# Altium schematic sheet EPS_Headers.SchDoc: UCI EPS 2021-22 Draft 1
size 304 x 254 mm; Origin: Eagle; Date: 3/6/2024 11:58:42 PM; SheetNumber: 1; GateName_1: G$1; SymbolName_1: FRAME_A_L; LibraryName: frames; DeviceSetName: FRAME_A_L; GateName_2: G$2; SymbolName_2: DOCFIELD; Sheet: Sheet:; REV: REV:
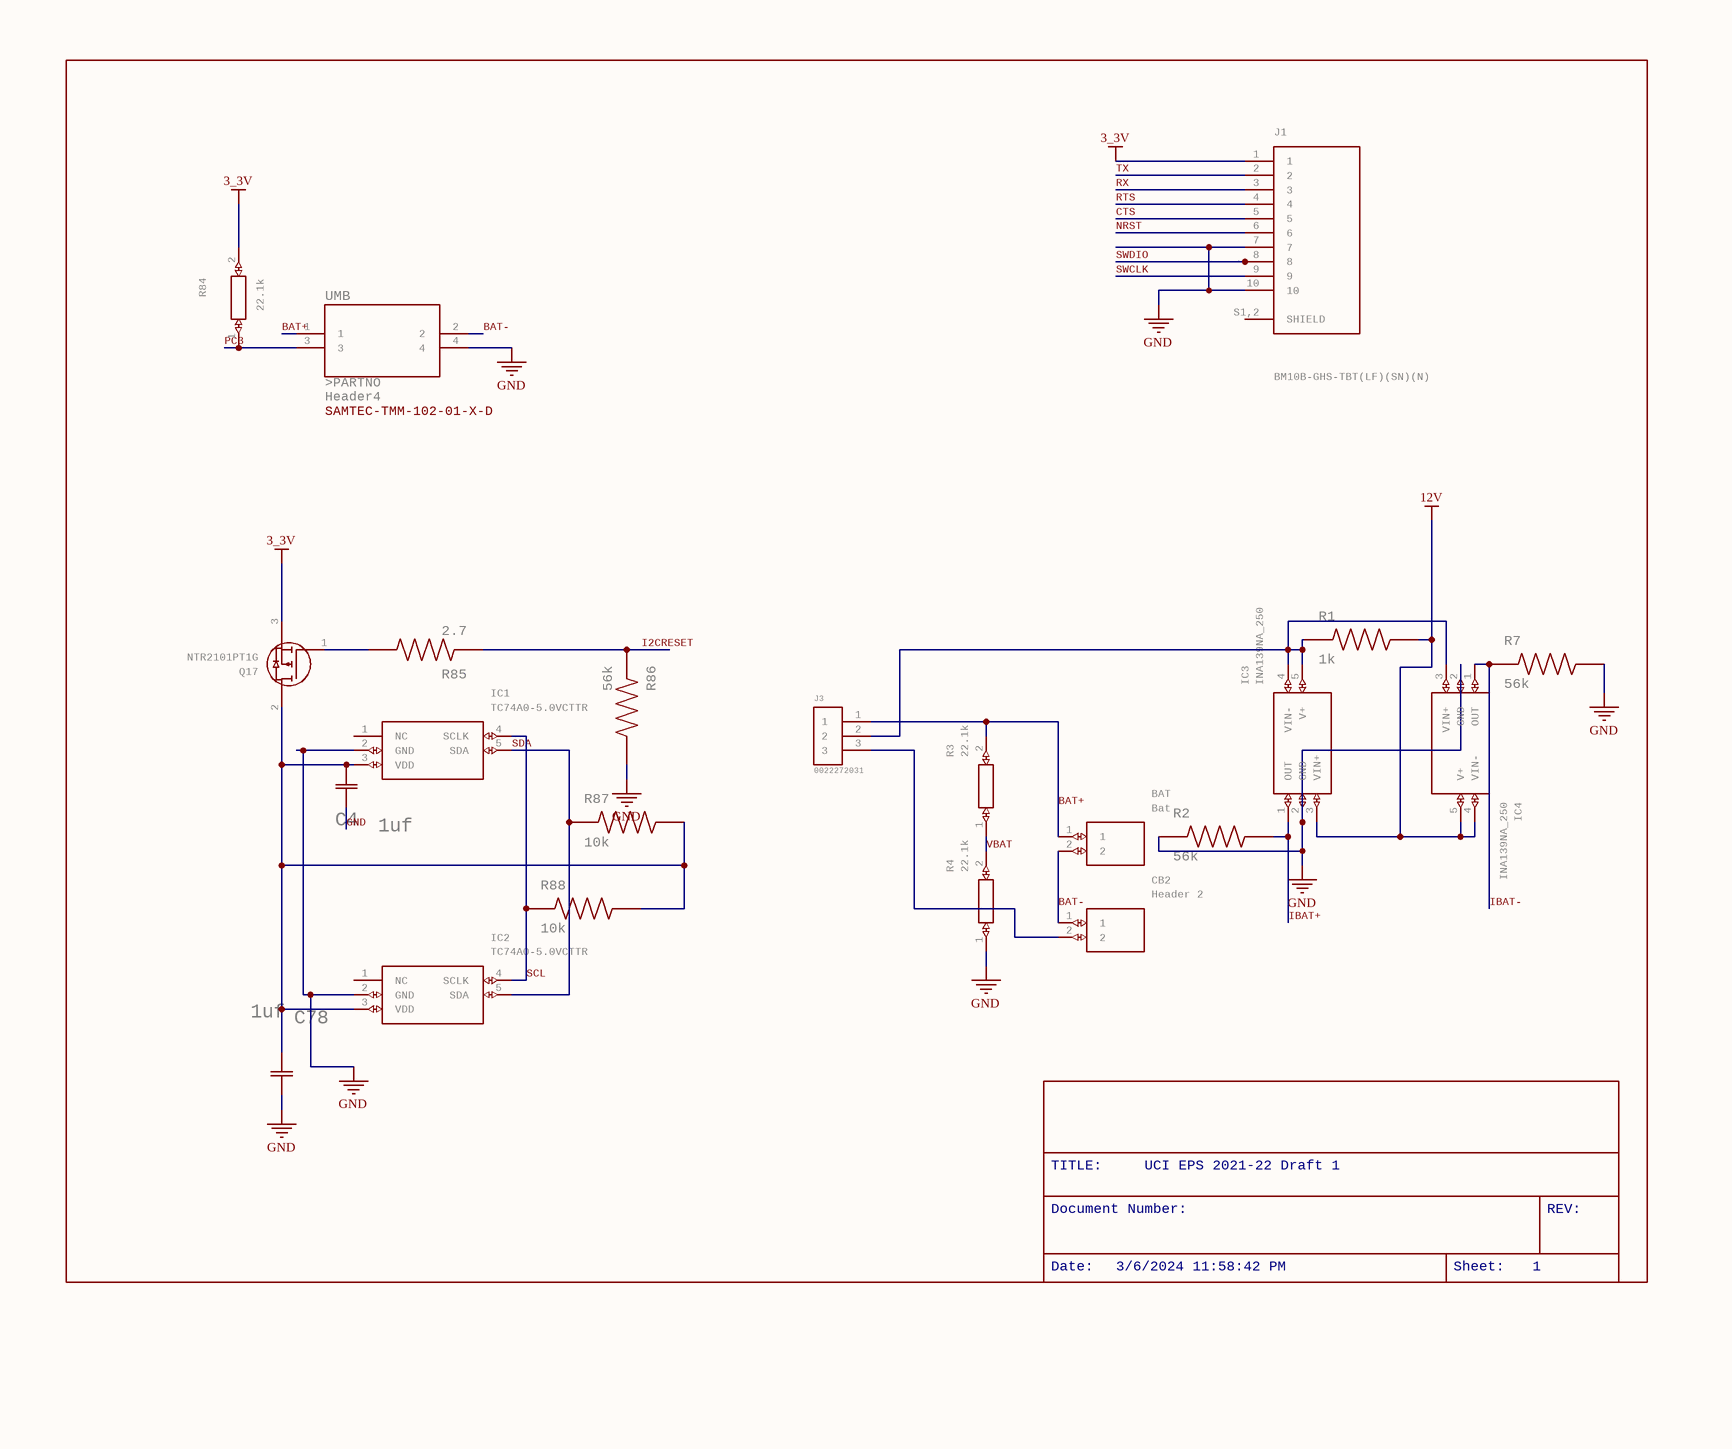
[diagram p0: EPS_Headers.SchDoc]

## Parts
BAT  Bat  [SHDR2W64P0X254_1X2_508X580X117]
C4  1uf  [YAG_CC0603_YAG-L]
C78  1uf  [YAG_CC0603_YAG]
CB2  Header 2  [SHDR2W64P0X254_1X2_508X580X117]
IC1  TC74A0-5.0VCTTR  [SOT95P280X145-5N]
IC2  TC74A0-5.0VCTTR  [SOT95P280X145-5N]
IC3  INA139NA_250  [SOT95P280X145-5N]
IC4  INA139NA_250  [SOT95P280X145-5N]
J1  BM10B-GHS-TBT(LF)(SN)(N)  [JST_BM10B-GHS-TBT(LF)(SN)(N)]
J3  0022272031  [MOLEX_0022272031]
Q17  NTR2101PT1G  [SOT96P237X111-3N]
R1  1k  [RESC1608X55N]
R2  56k  [RESC1608X55N]
R3  22.1k  [RESC1608X55N]
R4  22.1k  [RESC1608X55N]
R7  56k  [RESC1608X55N]
R84  22.1k  [RESC1608X55N]
R85  2.7  [RESC1608X55N]
R86  56k  [RESC1608X55N]
R87  10k  [RESC1608X55N]
R88  10k  [RESC1608X55N]
UMB  Header4  PARTNO: >PARTNO  [SAMTEC-TMM-102-01-X-D]

## Nets
3_3V: J1.1 Q17.3(D) R84.2
12V: IC3.3(VIN+) IC4.4(VIN-) IC4.5(V+) R1.2
GND: C4.1 C78.2 IC1.2(GND) IC2.2(GND) IC3.2(GND) IC4.2(GND) J1.7 J1.10 R2.1 R4.1 R7.2 R86.2 UMB.4
BAT+: BAT.1 J3.1 R3.2 UMB.1
BAT-: BAT.2 CB2.1 UMB.2
CTS: J1.5
I2CRESET: R85.1 R86.1
IBAT+: IC3.1(OUT) R2.2
IBAT-: IC4.1(OUT) R7.1
NRST: J1.6
PC3: R84.1 UMB.3
RTS: J1.4
RX: J1.3
SCL: IC1.4(SCLK) IC2.4(SCLK) R88.1
SDA: IC1.5(SDA) IC2.5(SDA) R87.1
SWCLK: J1.9
SWDIO: J1.8
TX: J1.2
VBAT: R3.1 R4.2
NetC4_2: C4.2 C78.1 IC1.3(VDD) IC2.3(VDD) Q17.2(S) R87.2 R88.2
NetCB2_2: CB2.2 J3.3
NetIC3_4: IC3.4(VIN-) IC3.5(V+) IC4.3(VIN+) J3.2 R1.1
NetQ17_1: Q17.1(G) R85.2

Not connected (* = marked no-connect by the designer): IC1 1(NC); IC2 1(NC); J1 S1,2(SHIELD)

## Notes on the sheet
- TITLE:
- UCI EPS 2021-22 Draft 1
- Document Number:
- REV:
- Date:
- 3/6/2024 11:58:42 PM
- Sheet:
- 1

## Library data of the parts
BAT CB2 = 0022272021: Conn Wire to Board HDR 2 POS 2.54mm Solder ST Thru-Hole KK Bag   Source:  Datasheet; MANUFACTURER_NAME: Molex; GateName_1: G$1; SymbolName_1: 0022272021; LibraryName: header 2; DeviceSetName: 0022272021; ARROW_PART_NUMBER: 0022272021; ARROW_PRICE-STOCK: https://www.arrow.com/en/products/0022272021/molex; HEIGHT: 11.7mm; MANUFACTURER_PART_NUMBER: 0022272021; MOUSER_PART_NUMBER: N/A; MOUSER_PRICE-STOCK: https://www.mouser.co.uk/ProductDetail/Molex/0022272021?qs=PBcRNPEHKsoTuJ7eDXMaUA%3D%3D
C4 = CC0603KRX7R7BB105YAG_CC0603_YAG-L: GateName_1: A; SymbolName_1: CAPH; BUILT_BY: EMA_UL_Team; SOURCELIBRARY: Yageo_2014-12-31; VENDOR: Yageo; DeviceName: YAG_CC0603_YAG-L; LibraryName: Cap 1uf; DeviceSetName: CC0603KRX7R7BB105; MANUFACTURER_PART_NUMBER: CC0603KRX7R7BB105
C78 = CC0603KRX7R7BB105: GateName_1: A; SymbolName_1: CAPH; BUILT_BY: EMA_UL_Team; SOURCELIBRARY: Yageo_2014-12-31; VENDOR: Yageo; LibraryName: Cap 1uf; DeviceSetName: CC0603KRX7R7BB105; MANUFACTURER_PART_NUMBER: CC0603KRX7R7BB105
IC1 IC2 = TC74A0-5.0VCTTR: Serial Digital Thermal Sensor   Source:  Datasheet; MANUFACTURER_NAME: Microchip; GateName_1: G$1; SymbolName_1: TC74A0-5.0VCTTR; LibraryName: TC74A0-5.0VCTTR; DeviceSetName: TC74A0-5.0VCTTR; ARROW_PART_NUMBER: TC74A0-5.0VCTTR; ARROW_PRICE-STOCK: https://www.arrow.com/en/products/tc74a0-5.0vcttr/microchip-technology; HEIGHT: 1.45mm; MANUFACTURER_PART_NUMBER: TC74A0-5.0VCTTR; MOUSER_PART_NUMBER: 579-TC74A0-5.0VCTTR; MOUSER_PRICE-STOCK: https://www.mouser.co.uk/ProductDetail/Microchip-Technology/TC74A0-50VCTTR?qs=RnzODY3cU8u6j2kV6CfePA%3D%3D
IC3 IC4 = INA139NA_250: 36V, High-Side, High-Speed, Current Output Current Sense Amplifier   Source:  Datasheet; MANUFACTURER_NAME: Texas Instruments; MANUFACTURER_PART_NUMBER: INA139NA/250; GateName_1: G$1; SymbolName_1: INA139NA_250; LibraryName: INA139NA_250; DeviceSetName: INA139NA_250; ARROW_PART_NUMBER: INA139NA/250; ARROW_PRICE-STOCK: https://www.arrow.com/en/products/ina139na250/texas-instruments; HEIGHT: 1.45mm; MOUSER_PART_NUMBER: 595-INA139NA/250; MOUSER_PRICE-STOCK: https://www.mouser.co.uk/ProductDetail/Texas-Instruments/INA139NA-250?qs=VBduBm9rCJQSYOixXF05Zw%3D%3D
J1 = BM10B-GHS-TBT(LF)(SN)(N): Connector Header Surface Mount 10 position 0.049" (1.25mm) Check prices; GateName_1: G$1; MF: JST Sales; SymbolName_1: BM10B-GHS-TBT(LF)(SN)(N); LibraryName: BM10B-GHS-TBT_LF__SN__N_; DeviceSetName: BM10B-GHS-TBT(LF)(SN)(N); AVAILABILITY: Not in stock; MP: BM10B-GHS-TBT(LF)(SN)(N); PACKAGE: None; PRICE: None
J3 = 0022272031: CONN HEADER 3POS .100 VERT TIN Check prices; GateName_1: G$1; MF: Molex; SymbolName_1: 0022272031; LibraryName: header 3; DeviceSetName: 0022272031; AVAILABILITY: Good; MP: 0022272031; PACKAGE: None; PRICE: None
Q17 = NTR2101PT1G: Small Signal MOSFET   Source:  Datasheet; MANUFACTURER_NAME: ON Semiconductor; GateName_1: G$1; SymbolName_1: NTR2101PT1G; LibraryName: MOSFET-P; DeviceSetName: NTR2101PT1G; ARROW_PART_NUMBER: NTR2101PT1G; ARROW_PRICE-STOCK: https://www.arrow.com/en/products/ntr2101pt1g/on-semiconductor; HEIGHT: 1.11mm; MANUFACTURER_PART_NUMBER: NTR2101PT1G; MOUSER_PART_NUMBER: 863-NTR2101PT1G; MOUSER_PRICE-STOCK: https://www.mouser.co.uk/ProductDetail/ON-Semiconductor/NTR2101PT1G?qs=ZXBb0xZ9WeAElbwG%2FHcx4g%3D%3D
R1 = ERJ-PB3D1001V: Res Thick Film 0603 1K Ohm 5% 0.2W(1/5W) Â±50ppm/C Pad SMD Automotive T/R; GateName_1: G$1; MF: Panasonic; SymbolName_1: ERJ-PB3D1001V; LibraryName: Res1 1k; DeviceSetName: ERJ-PB3D1001V; DIGI-KEY_PART_NUMBER: P20283CT-ND; MP: ERJ-PB3D1001V; PACKAGE: 1608 Panasonic Electronic Components
R2 R7 R86 = ERJ-PB3D5602V: RES SMD 56K OHM 0.5% 1/5W 0603; GateName_1: G$1; MF: Panasonic; SymbolName_1: ERJ-PB3D5602V; LibraryName: Res1 56k; DeviceSetName: ERJ-PB3D5602V; DIGI-KEY_PART_NUMBER: DIGI-KEY_PART_NUMBER; MP: ERJ-PB3D5602V; PACKAGE: 1608 Panasonic Electronic Components
R3 R4 R84 = ERJPB3D2212V: hj   Source:  Datasheet; MANUFACTURER_NAME: Panasonic; GateName_1: G$1; SymbolName_1: ERJPB3D2212V; LibraryName: Res1-22.1k; DeviceSetName: ERJPB3D2212V; ARROW_PART_NUMBER: ARROW_PART_NUMBER; ARROW_PRICE-STOCK: ARROW_PRICE-STOCK; HEIGHT: 0.55mm; MANUFACTURER_PART_NUMBER: ERJPB3D2212V; MOUSER_PART_NUMBER: MOUSER_PART_NUMBER; MOUSER_PRICE-STOCK: MOUSER_PRICE-STOCK
R85 = RL0816S-2R7-F: GateName_1: G$1; MF: Susumu; SymbolName_1: RL0816S-2R7-F; LibraryName: Res1-2.7; DeviceSetName: RL0816S-2R7-F; DIGI-KEY_PART_NUMBER: DIGI-KEY_PART_NUMBER; MP: RL0816S-2R7-F; PACKAGE: 1608 Susumu
R87 R88 = ERJ-PB3D1002V: Res Thick Film 0603 10K Ohm 5% 0.2W(1/5W) Â±50ppm/C Pad SMD Automotive T/R; GateName_1: G$1; MF: Panasonic Electronic; SymbolName_1: ERJ-PB3D1002V; LibraryName: Res1 10k; DeviceSetName: ERJ-PB3D1002V; DIGI-KEY_PART_NUMBER: DIGI-KEY_PART_NUMBER; MP: ERJ-PB3D1002V; PACKAGE: 1608 Panasonic Electronic Components
UMB = SAMTEC-TMM-102-01-X-DJ: Check prices; GateName_1: A; SymbolName_1: SAMTEC-TMM-102-01-X-DA; DeviceName: J; MF: Samtec Inc.; MP: TMM-102-01-T-D; LibraryName: 4 pin header replace; DeviceSetName: SAMTEC-TMM-102-01-X-D; SAMTEC-TMM-102-01-X-D: SAMTEC-TMM-102-01-X-D; AVAILABILITY: In Stock; PACKAGE: None; PRICE: None; PURCHASE-URL: https://pricing.snapeda.com/search/part/TMM-102-01-T-D/?ref=eda